// Quartus schematic minimal.bdf as structural Verilog: 2 symbols, 2 pins
module minimal (
  input  A,
  output Y
);

  wire first_out;

  BUF first (.IN(A), .OUT(first_out));
  BUF second (.IN(first_out), .OUT(Y));
endmodule
